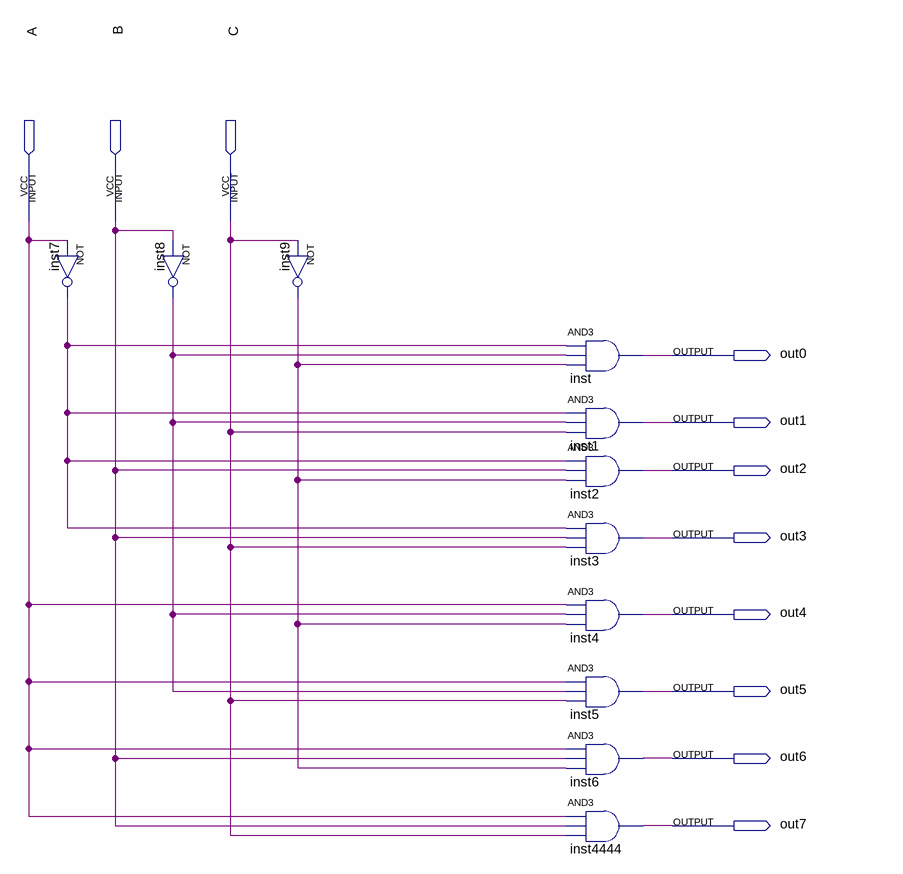
[diagram p0: schematic sheet]
// Quartus schematic decod3x8.bdf as structural Verilog: 11 symbols, 11 pins
module decod3x8 (
  input  A,
  input  B,
  input  C,
  output out0,
  output out1,
  output out2,
  output out3,
  output out4,
  output out5,
  output out6,
  output out7
);

  wire inst7_out, inst8_out, inst9_out;

  not inst7 (inst7_out, A);
  not inst8 (inst8_out, B);
  not inst9 (inst9_out, C);
  and inst (out0, inst7_out, inst8_out, inst9_out);
  and inst1 (out1, inst7_out, inst8_out, C);
  and inst2 (out2, inst7_out, B, inst9_out);
  and inst3 (out3, inst7_out, B, C);
  and inst4 (out4, A, inst8_out, inst9_out);
  and inst5 (out5, A, inst8_out, C);
  and inst6 (out6, A, B, inst9_out);
  and inst4444 (out7, A, B, C);
endmodule
